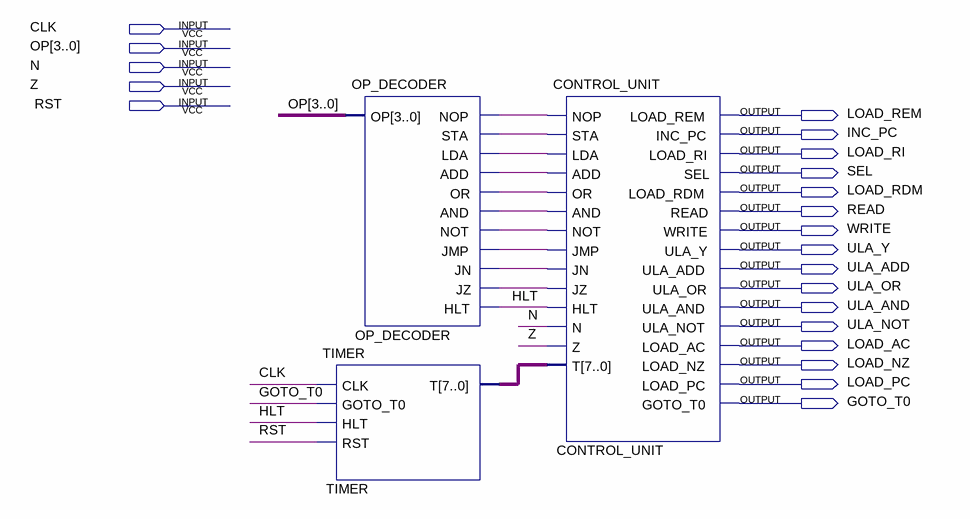
[diagram p0: schematic sheet]
// Quartus schematic LAB10.bdf as structural Verilog: 3 symbols, 21 pins
module LAB10 (
  input  CLK,
  input  [3:0] OP,
  input  N,
  input  Z,
  input  RST,
  output LOAD_REM,
  output INC_PC,
  output LOAD_RI,
  output SEL,
  output LOAD_RDM,
  output READ,
  output WRITE,
  output ULA_Y,
  output ULA_ADD,
  output ULA_OR,
  output ULA_AND,
  output ULA_NOT,
  output LOAD_AC,
  output LOAD_NZ,
  output LOAD_PC,
  output GOTO_T0
);

  wire HLT, OP_DECODER_add, OP_DECODER_and, OP_DECODER_jmp, OP_DECODER_jn, OP_DECODER_jz, OP_DECODER_lda,
       OP_DECODER_nop, OP_DECODER_not, OP_DECODER_or, OP_DECODER_sta;
  wire [7:0] TIMER_t;

  OP_DECODER OP_DECODER (
    .OP(OP), .NOP(OP_DECODER_nop), .STA(OP_DECODER_sta), .LDA(OP_DECODER_lda), .ADD(OP_DECODER_add),
    .OR(OP_DECODER_or), .AND(OP_DECODER_and), .NOT(OP_DECODER_not), .JMP(OP_DECODER_jmp), .JN(OP_DECODER_jn),
    .JZ(OP_DECODER_jz), .HLT(HLT));
  TIMER TIMER (.CLK(CLK), .GOTO_T0(GOTO_T0), .HLT(HLT), .RST(RST), .T(TIMER_t));
  CONTROL_UNIT CONTROL_UNIT (
    .NOP(OP_DECODER_nop), .STA(OP_DECODER_sta), .LDA(OP_DECODER_lda), .ADD(OP_DECODER_add),
    .OR(OP_DECODER_or), .AND(OP_DECODER_and), .NOT(OP_DECODER_not), .JMP(OP_DECODER_jmp), .JN(OP_DECODER_jn),
    .JZ(OP_DECODER_jz), .HLT(HLT), .N(N), .Z(Z), .T(TIMER_t), .LOAD_REM(LOAD_REM), .INC_PC(INC_PC),
    .LOAD_RI(LOAD_RI), .SEL(SEL), .LOAD_RDM(LOAD_RDM), .READ(READ), .WRITE(WRITE), .ULA_Y(ULA_Y),
    .ULA_ADD(ULA_ADD), .ULA_OR(ULA_OR), .ULA_AND(ULA_AND), .ULA_NOT(ULA_NOT), .LOAD_AC(LOAD_AC),
    .LOAD_NZ(LOAD_NZ), .LOAD_PC(LOAD_PC), .GOTO_T0(GOTO_T0));
endmodule
